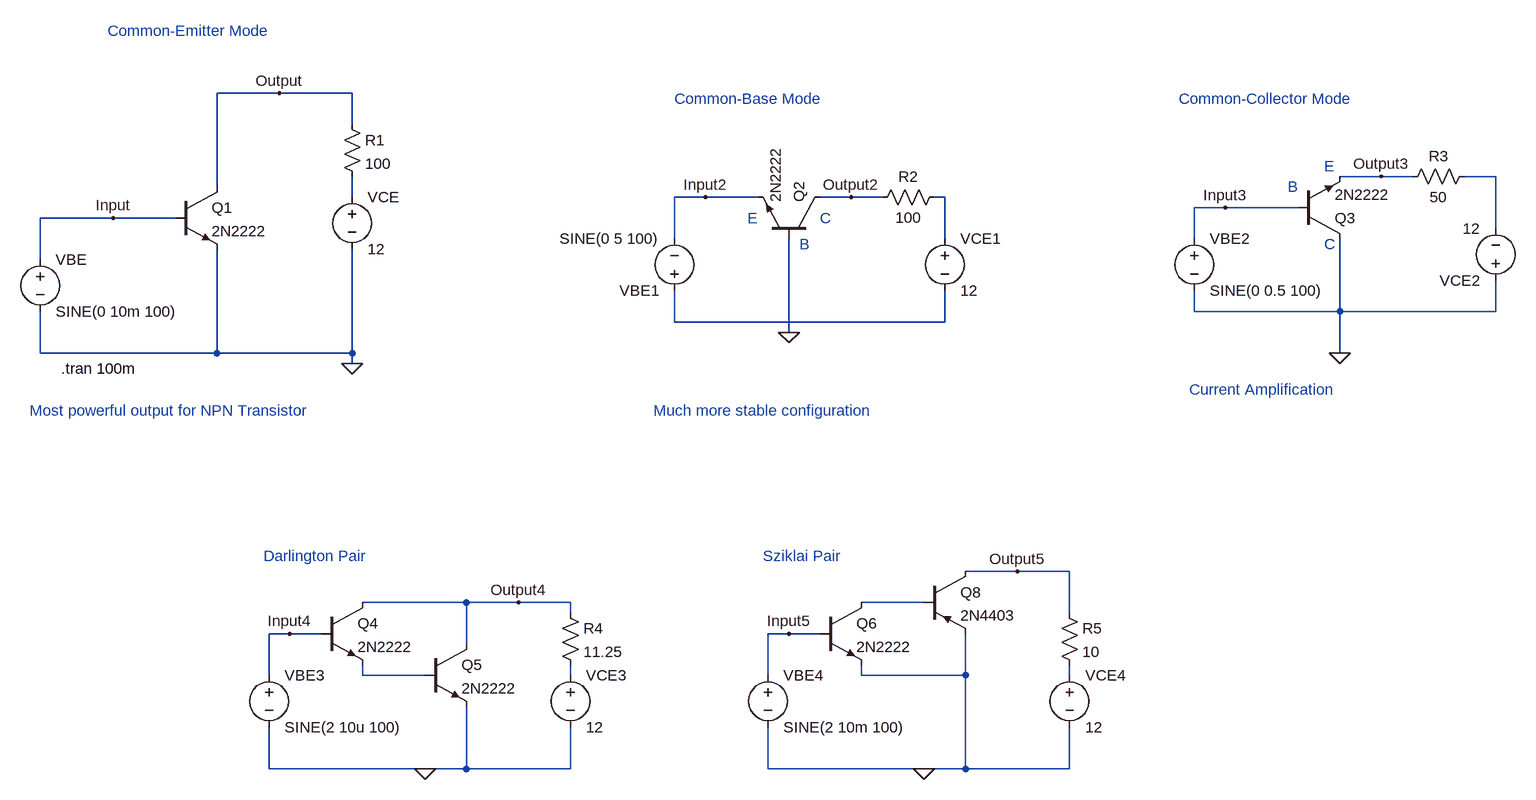
[diagram p0: schematic Transistors.asc]
Transistors.asc, the LTspice schematic file:
Version 4
SHEET 1 2888 1256
WIRE 688 -32 592 -32
WIRE 800 -32 688 -32
WIRE 800 16 800 -32
WIRE 2384 96 2320 96
WIRE 2432 96 2384 96
WIRE 2560 96 2512 96
WIRE 592 112 592 -32
WIRE 800 128 800 96
WIRE 1344 128 1296 128
WIRE 1424 128 1344 128
WIRE 1568 128 1520 128
WIRE 1616 128 1568 128
WIRE 1712 128 1696 128
WIRE 2144 144 2096 144
WIRE 2256 144 2144 144
WIRE 432 160 320 160
WIRE 528 160 432 160
WIRE 2560 176 2560 96
WIRE 1296 192 1296 128
WIRE 1712 192 1712 128
WIRE 2096 192 2096 144
WIRE 320 224 320 160
WIRE 2096 304 2096 272
WIRE 2320 304 2320 192
WIRE 2320 304 2096 304
WIRE 2560 304 2560 256
WIRE 2560 304 2320 304
WIRE 1296 320 1296 272
WIRE 1712 320 1712 272
WIRE 1712 320 1296 320
WIRE 1472 336 1472 192
WIRE 320 368 320 304
WIRE 592 368 592 208
WIRE 592 368 320 368
WIRE 800 368 800 208
WIRE 800 368 592 368
WIRE 2320 368 2320 304
WIRE 800 384 800 368
WIRE 1824 704 1744 704
WIRE 1904 704 1824 704
WIRE 976 752 816 752
WIRE 1056 752 976 752
WIRE 1136 752 1056 752
WIRE 1680 752 1584 752
WIRE 1136 768 1136 752
WIRE 1904 768 1904 704
WIRE 704 800 672 800
WIRE 752 800 704 800
WIRE 1472 800 1440 800
WIRE 1520 800 1472 800
WIRE 976 816 976 752
WIRE 672 864 672 800
WIRE 816 864 816 848
WIRE 912 864 816 864
WIRE 1136 864 1136 848
WIRE 1440 864 1440 800
WIRE 1584 864 1584 848
WIRE 1744 864 1744 800
WIRE 1744 864 1584 864
WIRE 1904 864 1904 848
WIRE 672 1008 672 944
WIRE 912 1008 672 1008
WIRE 976 1008 976 912
WIRE 976 1008 912 1008
WIRE 1136 1008 1136 944
WIRE 1136 1008 976 1008
WIRE 1440 1008 1440 944
WIRE 1680 1008 1440 1008
WIRE 1744 1008 1744 864
WIRE 1744 1008 1680 1008
WIRE 1904 1008 1904 944
WIRE 1904 1008 1744 1008
FLAG 800 384 0
FLAG 688 -32 Output
FLAG 432 160 Input
FLAG 1472 336 0
FLAG 1568 128 Output2
FLAG 1344 128 Input2
FLAG 2320 368 0
FLAG 2384 96 Output3
FLAG 2144 144 Input3
FLAG 1056 752 Output4
FLAG 704 800 Input4
FLAG 912 1008 0
FLAG 1824 704 Output5
FLAG 1472 800 Input5
FLAG 1680 1008 0
SYMBOL npn 528 112 R0
SYMATTR InstName Q1
SYMATTR Value 2N2222
SYMBOL voltage 320 208 R0
WINDOW 123 0 0 Left 0
WINDOW 39 0 0 Left 0
SYMATTR InstName VBE
SYMATTR Value SINE(0 10m 100)
SYMBOL voltage 800 112 R0
WINDOW 123 0 0 Left 0
WINDOW 39 0 0 Left 0
SYMATTR InstName VCE
SYMATTR Value 12
SYMBOL res 784 0 R0
SYMATTR InstName R1
SYMATTR Value 100
SYMBOL npn 1520 192 M270
SYMATTR InstName Q2
SYMATTR Value 2N2222
SYMBOL voltage 1296 288 R180
WINDOW 123 0 0 Left 0
WINDOW 39 0 0 Left 0
SYMATTR InstName VBE1
SYMATTR Value SINE(0 5 100)
SYMBOL voltage 1712 176 R0
WINDOW 123 0 0 Left 0
WINDOW 39 0 0 Left 0
SYMATTR InstName VCE1
SYMATTR Value 12
SYMBOL res 1712 112 R90
WINDOW 0 0 56 VBottom 2
WINDOW 3 32 56 VTop 2
SYMATTR InstName R2
SYMATTR Value 100
SYMBOL npn 2256 192 M180
SYMATTR InstName Q3
SYMATTR Value 2N2222
SYMBOL voltage 2096 176 R0
WINDOW 123 0 0 Left 0
WINDOW 39 0 0 Left 0
SYMATTR InstName VBE2
SYMATTR Value SINE(0 0.5 100)
SYMBOL voltage 2560 272 R180
WINDOW 123 0 0 Left 0
WINDOW 39 0 0 Left 0
SYMATTR InstName VCE2
SYMATTR Value 12
SYMBOL res 2416 112 R270
WINDOW 0 32 56 VTop 2
WINDOW 3 0 56 VBottom 2
SYMATTR InstName R3
SYMATTR Value 50
SYMBOL npn 752 752 R0
SYMATTR InstName Q4
SYMATTR Value 2N2222
SYMBOL npn 912 816 R0
SYMATTR InstName Q5
SYMATTR Value 2N2222
SYMBOL voltage 672 848 R0
WINDOW 123 0 0 Left 0
WINDOW 39 0 0 Left 0
SYMATTR InstName VBE3
SYMATTR Value SINE(2 10u 100)
SYMBOL voltage 1136 848 R0
WINDOW 123 0 0 Left 0
WINDOW 39 0 0 Left 0
SYMATTR InstName VCE3
SYMATTR Value 12
SYMBOL res 1120 752 R0
SYMATTR InstName R4
SYMATTR Value 11.25
SYMBOL npn 1520 752 R0
SYMATTR InstName Q6
SYMATTR Value 2N2222
SYMBOL voltage 1440 848 R0
WINDOW 123 0 0 Left 0
WINDOW 39 0 0 Left 0
SYMATTR InstName VBE4
SYMATTR Value SINE(2 10m 100)
SYMBOL voltage 1904 848 R0
WINDOW 123 0 0 Left 0
WINDOW 39 0 0 Left 0
SYMATTR InstName VCE4
SYMATTR Value 12
SYMBOL res 1888 752 R0
SYMATTR InstName R5
SYMATTR Value 10
SYMBOL pnp 1680 704 R0
SYMATTR InstName Q8
SYMATTR Value 2N4403
TEXT 352 392 Left 2 !.tran 100m
TEXT 424 -128 Left 2 ;Common-Emitter Mode
TEXT 1296 -24 Left 2 ;Common-Base Mode
TEXT 304 456 Left 2 ;Most powerful output for NPN Transistor
TEXT 1408 160 Left 2 ;E
TEXT 1488 200 Left 2 ;B
TEXT 1520 160 Left 2 ;C
TEXT 1264 456 Left 2 ;Much more stable configuration
TEXT 2072 -24 Left 2 ;Common-Collector Mode
TEXT 2296 80 Left 2 ;E
TEXT 2240 112 Left 2 ;B
TEXT 2296 200 Left 2 ;C
TEXT 2088 424 Left 2 ;Current Amplification
TEXT 664 680 Left 2 ;Darlington Pair
TEXT 1432 680 Left 2 ;Sziklai Pair

The netlist it stands for:
* Transistors.asc
Q1 Output Input 0 0 2N2222
VBE Input 0 SINE(0 10m 100)
VCE N002 0 12
R1 Output N002 100
Q2 Output2 0 Input2 0 2N2222
VBE1 N004 Input2 SINE(0 5 100)
VCE1 N003 N004 12
R2 N003 Output2 100
Q3 0 Input3 Output3 0 2N2222
VBE2 Input3 0 SINE(0 0.5 100)
VCE2 0 N001 12
R3 Output3 N001 50
Q4 Output4 Input4 N006 0 2N2222
Q5 Output4 N006 0 0 2N2222
VBE3 Input4 0 SINE(2 10u 100)
VCE3 N007 0 12
R4 Output4 N007 11.25
Q6 N005 Input5 0 0 2N2222
VBE4 Input5 0 SINE(2 10m 100)
VCE4 N008 0 12
R5 Output5 N008 10
Q8 Output5 N005 0 0 2N4403
.model NPN NPN
.model PNP PNP
.lib standard.bjt
.tran 100m
* Common-Emitter Mode
* Common-Base Mode
* Most powerful output for NPN Transistor
* E
* B
* C
* Much more stable configuration
* Common-Collector Mode
* E
* B
* C
* Current Amplification
* Darlington Pair
* Sziklai Pair
.backanno
.end